# EAGLE schematic PanningMixer (EAGLE 7.5.0)
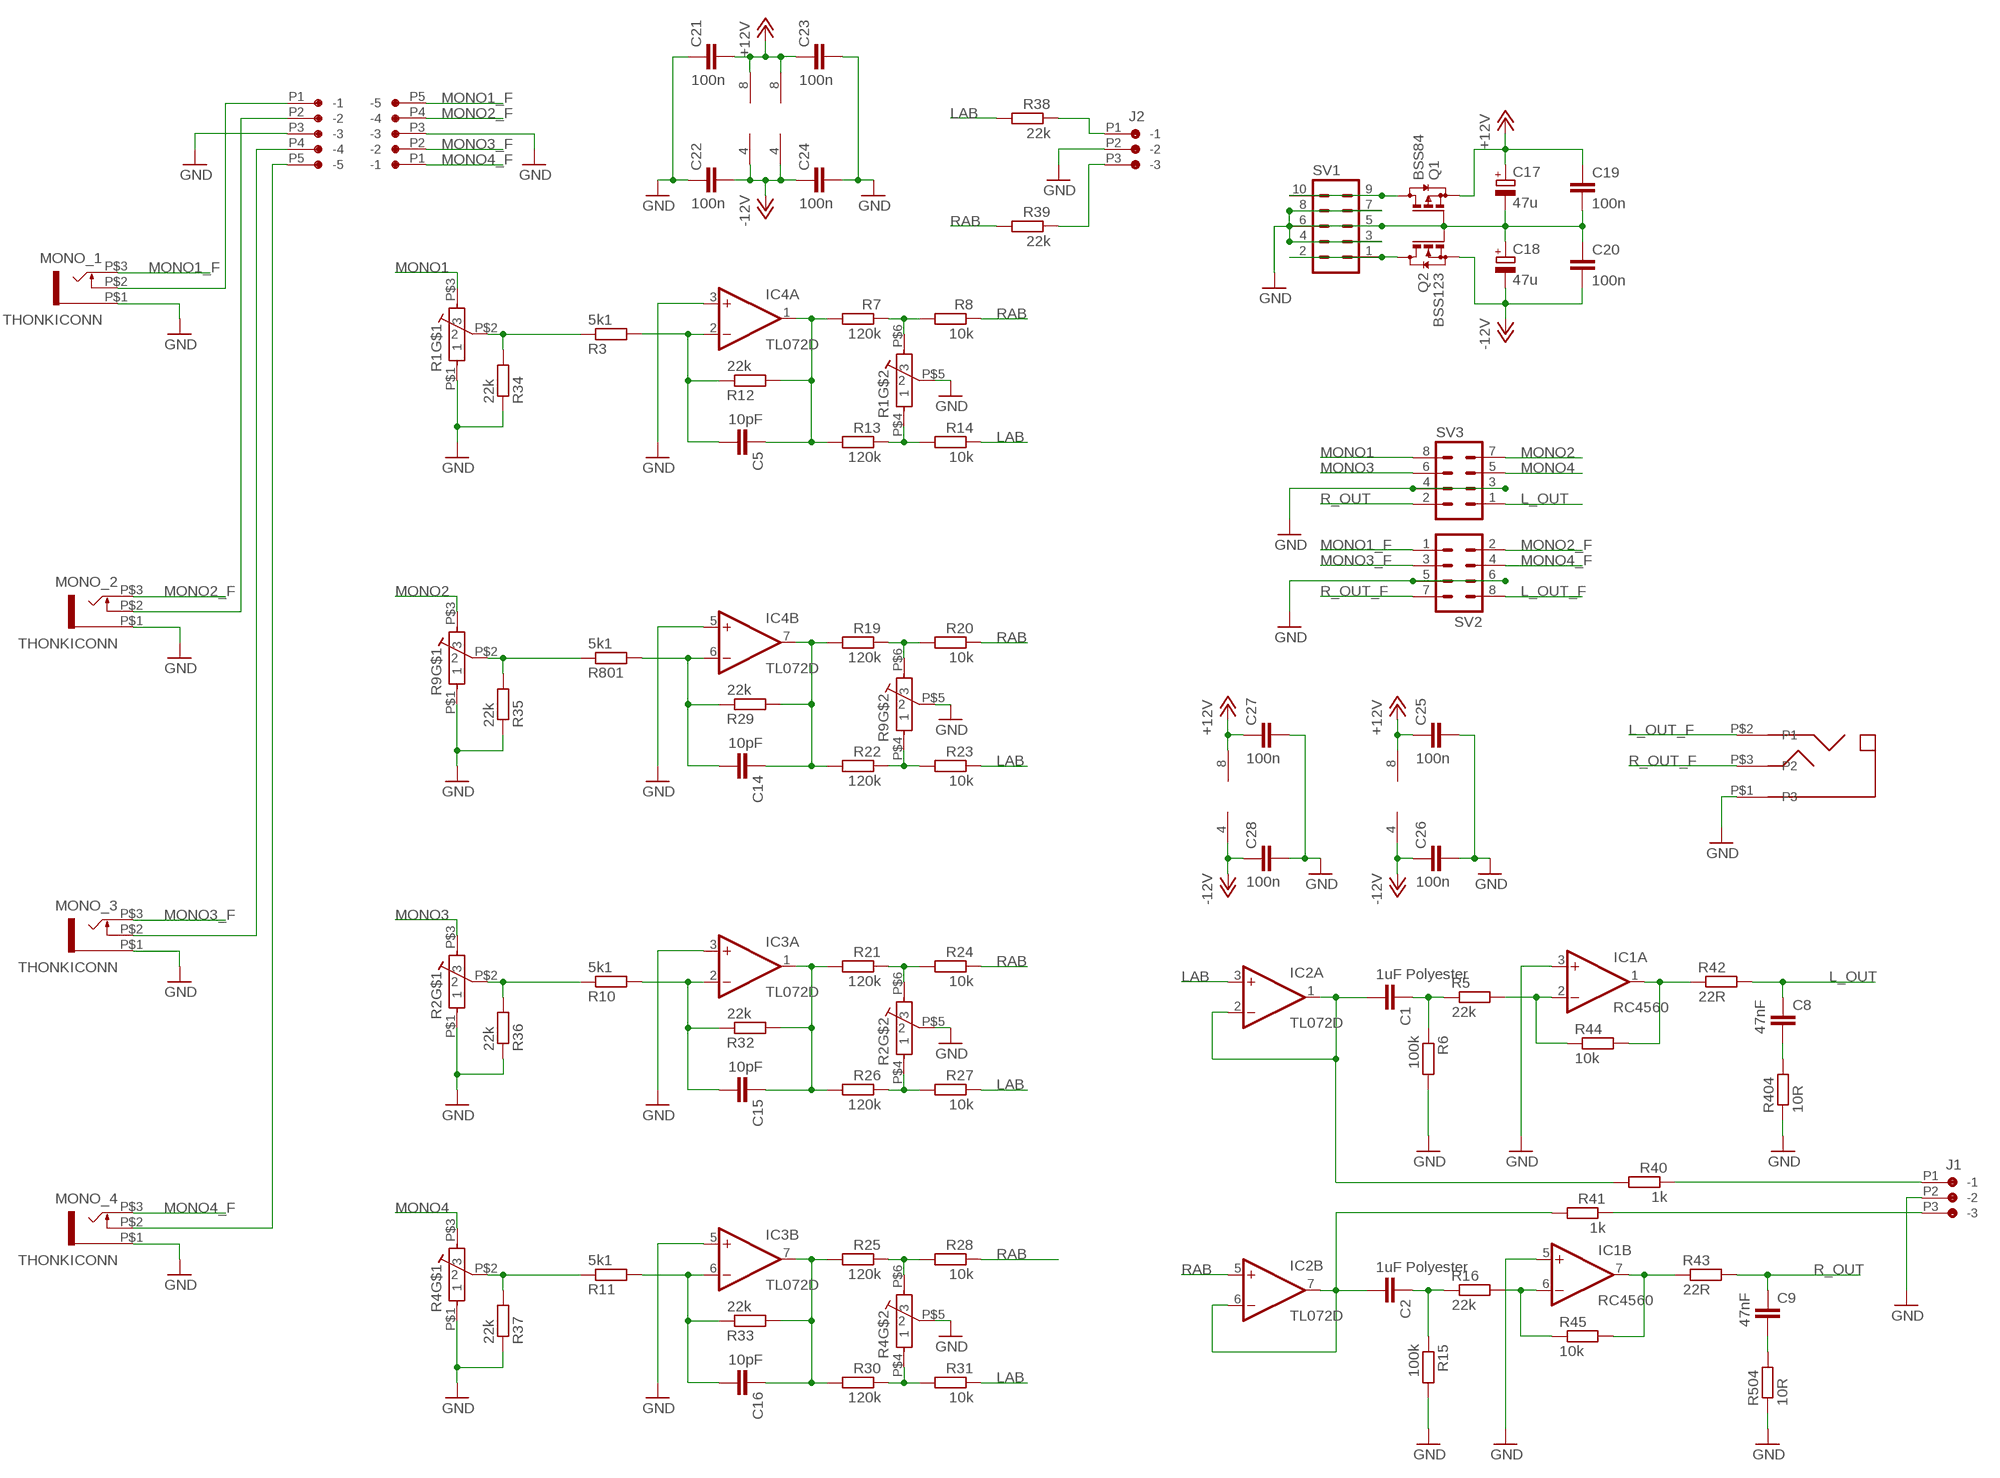
[diagram p0: schematic, sheet 1]

## Parts
C1  1uF Polyester  C-EUC1210  [C1210]
C2  1uF Polyester  C-EUC1210  [C1210]
C5  10pF  C-EUC0603  [C0603]
C8  47nF  C-EUC0603  [C0603]
C9  47nF  C-EUC0603  [C0603]
C14  10pF  C-EUC0603  [C0603]
C15  10pF  C-EUC0603  [C0603]
C16  10pF  C-EUC0603  [C0603]
C17  47u  CPOL-EUB  [PANASONIC_B]
C18  47u  CPOL-EUB  [PANASONIC_B]
C19  100n  C-EUC0603  [C0603]
C20  100n  C-EUC0603  [C0603]
C21  100n  C-EUC0603  [C0603]
C22  100n  C-EUC0603  [C0603]
C23  100n  C-EUC0603  [C0603]
C24  100n  C-EUC0603  [C0603]
C25  100n  C-EUC0603  [C0603]
C26  100n  C-EUC0603  [C0603]
C27  100n  C-EUC0603  [C0603]
C28  100n  C-EUC0603  [C0603]
IC1  RC4560  RC4559D  [SO08]
IC2  TL072D  [SO08]
IC3  TL072D  [SO08]
IC4  TL072D  [SO08]
J1  CON-JST_PH_3W  [CON-JST_PH_3W]
J2  CON-JST_PH_3W  [CON-JST_PH_3W]
MONO_1  THONKICONN  [THONKICONN]
MONO_2  THONKICONN  [THONKICONN]
MONO_3  THONKICONN  [THONKICONN]
MONO_4  THONKICONN  [THONKICONN]
Q1  BSS84  [SOT23]
Q2  BSS123  [SOT23]
R1  POT-ALPHA_DUAL_9MM  [POT-ALPA_DUAL_9MM]
R2  POT-ALPHA_DUAL_9MM  [POT-ALPA_DUAL_9MM]
R3  5k1  R-EU_0603  [0603]
R4  POT-ALPHA_DUAL_9MM  [POT-ALPA_DUAL_9MM]
R5  22k  R-EU_0603  [0603]
R6  100k  R-EU_0603  [0603]
R7  120k  R-EU_0603  [0603]
R8  10k  R-EU_0603  [0603]
R9  POT-ALPHA_DUAL_9MM  [POT-ALPA_DUAL_9MM]
R10  5k1  R-EU_0603  [0603]
R11  5k1  R-EU_0603  [0603]
R12  22k  R-EU_0603  [0603]
R13  120k  R-EU_0603  [0603]
R14  10k  R-EU_0603  [0603]
R15  100k  R-EU_0603  [0603]
R16  22k  R-EU_0603  [0603]
R19  120k  R-EU_0603  [0603]
R20  10k  R-EU_0603  [0603]
R21  120k  R-EU_0603  [0603]
R22  120k  R-EU_0603  [0603]
R23  10k  R-EU_0603  [0603]
R24  10k  R-EU_0603  [0603]
R25  120k  R-EU_0603  [0603]
R26  120k  R-EU_0603  [0603]
R27  10k  R-EU_0603  [0603]
R28  10k  R-EU_0603  [0603]
R29  22k  R-EU_0603  [0603]
R30  120k  R-EU_0603  [0603]
R31  10k  R-EU_0603  [0603]
R32  22k  R-EU_0603  [0603]
R33  22k  R-EU_0603  [0603]
R34  22k  R-EU_0603  [0603]
R35  22k  R-EU_0603  [0603]
R36  22k  R-EU_0603  [0603]
R37  22k  R-EU_0603  [0603]
R38  22k  R-EU_0603  [0603]
R39  22k  R-EU_0603  [0603]
R40  1k  R-EU_0603  [0603]
R41  1k  R-EU_0603  [0603]
R42  22R  R-EU_0603  [0603]
R43  22R  R-EU_0603  [0603]
R44  10k  R-EU_0603  [0603]
R45  10k  R-EU_0603  [0603]
R404  10R  R-EU_0603  [0603]
R504  10R  R-EU_0603  [0603]
R801  5k1  R-EU_0603  [0603]
SV1  MA05-2  [MA05-2]
SV2  MA04-2  [MA04-2]
SV3  MA04-2  [MA04-2]
U1  CON-PROSIGNAL_MJ-355W  [CON-PROSIGNAL_MJ-355W]
U2  CON-JST_PH_5W  [CON-JST_PH_5W]
U4  CON-JST_PH_5W  [CON-JST_PH_5W]

## Nets
+12V: C17.+ C19.1 C21.2 C23.1 C25.1 C27.1 IC1.8(P:V+) IC2.8(P:V+) IC3.8(P:V+) IC4.8(P:V+) Q1.2(S)
-12V: C18.- C20.2 C22.2 C24.1 C26.1 C28.1 IC1.4(P:V-) IC2.4(P:V-) IC3.4(P:V-) IC4.4(P:V-) Q2.2(S)
GND: C17.- C18.+ C19.2 C20.1 C21.1 C22.1 C23.2 C24.2 C25.2 C26.2 C27.2 C28.2 IC1.3(A:+IN) IC1.5(B:+IN) IC3.3(A:+IN) IC3.5(B:+IN) IC4.3(A:+IN) IC4.5(B:+IN) J1.P2(-2) J2.P2(-2) Q1.1(G) Q2.1(G) R1.P$1 R1.P$5 R2.P$1 R2.P$5 R4.P$1 R4.P$5 R6.2 R9.P$1 R9.P$5 R15.2 R34.1 R35.1 R36.1 R37.1 R404.1 R504.1 SV1.3 SV1.4 SV1.5 SV1.6 SV1.7 SV1.8 SV3.3 SV3.4
GND_A: MONO_1.P$1 MONO_2.P$1 MONO_3.P$1 MONO_4.P$1 SV2.5 SV2.6 U1.P$1(P3) U2.P3(-3) U4.P3(-3) ; supply symbol labelled GND
L_OUT: C8.1 R42.2 SV3.1
L_OUT_F: SV2.8 U1.P$2(P1)
LAB: IC2.3(A:+IN) R14.1 R23.1 R27.1 R31.1 R38.2
MONO1: R1.P$3 SV3.8
MONO1_F: MONO_1.P$3 SV2.1 U4.P5(-5)
MONO2: R9.P$3 SV3.7
MONO2_F: MONO_2.P$3 SV2.2 U4.P4(-4)
MONO3: R2.P$3 SV3.6
MONO3_F: MONO_3.P$3 SV2.3 U4.P2(-2)
MONO4: R4.P$3 SV3.5
MONO4_F: MONO_4.P$3 SV2.4 U4.P1(-1)
N$1: R4.P$2 R11.1 R37.2
N$2: MONO_2.P$2 U2.P2(-2)
N$4: MONO_1.P$2 U2.P1(-1)
N$5: C1.1 R5.1 R6.1
N$6: MONO_3.P$2 U2.P4(-4)
N$7: IC1.2(A:-IN) R5.2 R44.1
N$8: R1.P$2 R3.1 R34.2
N$9: C5.2 IC4.2(A:-IN) R3.2 R12.1
N$10: R2.P$2 R10.1 R36.2
N$11: R9.P$2 R35.2 R801.1
N$12: C9.2 R504.2
N$14: J2.P1(-1) R38.1
N$15: MONO_4.P$2 U2.P5(-5)
N$16: J1.P1(-1) R40.1
N$17: R1.P$4 R13.1 R14.2
N$19: R1.P$6 R7.1 R8.2
N$20: J1.P3(-3) R41.1
N$21: C8.2 R404.2
N$22: C2.1 R15.1 R16.1
N$23: C5.1 IC4.1(A:OUT) R7.2 R12.2 R13.2
N$24: J2.P3(-3) R39.1
N$25: C16.1 IC3.7(B:OUT) R25.2 R30.2 R33.2
N$26: C14.1 IC4.7(B:OUT) R19.2 R22.2 R29.2
N$27: IC1.1(A:OUT) R42.1 R44.2
N$28: IC1.6(B:-IN) R16.2 R45.1
N$30: C1.2 IC2.1(A:OUT) IC2.2(A:-IN) R40.2
N$31: IC1.7(B:OUT) R43.1 R45.2
N$32: C2.2 IC2.6(B:-IN) IC2.7(B:OUT) R41.2
N$33: R9.P$6 R19.1 R20.2
N$35: R9.P$4 R22.1 R23.2
N$36: R2.P$6 R21.1 R24.2
N$37: C15.1 IC3.1(A:OUT) R21.2 R26.2 R32.2
N$38: R2.P$4 R26.1 R27.2
N$39: R4.P$6 R25.1 R28.2
N$41: R4.P$4 R30.1 R31.2
N$43: C14.2 IC4.6(B:-IN) R29.1 R801.2
N$44: Q2.3(D) SV1.1 SV1.2
N$45: C15.2 IC3.2(A:-IN) R10.2 R32.1
N$46: Q1.3(D) SV1.9 SV1.10
N$47: C16.2 IC3.6(B:-IN) R11.2 R33.1
R_OUT: C9.1 R43.2 SV3.2
R_OUT_F: SV2.7 U1.P$3(P2)
RAB: IC2.5(B:+IN) R8.1 R20.1 R24.1 R28.1 R39.2

## Library data of the parts
C1 C2 C5 C8 C9 C14-C16 C19-C28 = Rebel:C-EU: CAPACITOR, European symbol
C17 C18 = Rebel:CPOL-EU: POLARIZED CAPACITOR, European symbol
IC1 = linear:RC4559: OP AMP
IC2-IC4 = linear:TL072: OP AMP
J1 J2 = Rebel:CON-JST_PH_3W
MONO_1-MONO_4 = Rebel:THONKICONN
Q1 = transistor-small-signal:BSS84: P-CHANNEL MOS FET
Q2 = transistor-small-signal:BSS123: N-CHANNEL MOS FET
R1 R2 R4 R9 = Rebel:POT-ALPHA_DUAL_9MM
R3 R5-R8 R10-R16 R19-R45 R404 R504 R801 = Rebel:R-EU_: RESISTOR, European symbol
SV1 = con-lstb:MA05-2: PIN HEADER; OC_FARNELL: unknown; OC_NEWARK: unknown
SV2 SV3 = con-lstb:MA04-2: PIN HEADER; OC_FARNELL: unknown; OC_NEWARK: unknown
U1 = Rebel:CON-PROSIGNAL_MJ-355W
U2 U4 = Rebel:CON-JST_PH_5W